# Altium schematic sheet VCO.SchDoc
size A4
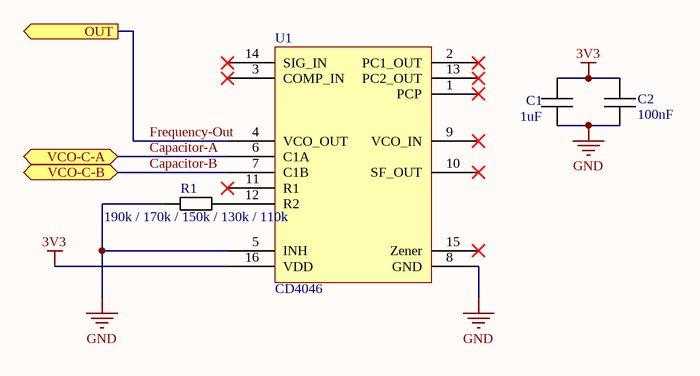
[diagram p0: VCO.SchDoc]

## Parts
C1  1uF  [C 0805 / 2012]
C2  100nF  [C 0805 / 2012]
R1  190k / 170k / 150k / 130k / 110k  [R 0805 / 2012]
U1  CD4046  [SOIC-16]

## Ports
OUT (out), VCO-C-A (bidir), VCO-C-B (bidir)

## Nets
3V3: C1.1 C2.1 U1.16(VDD)
GND: C1.2 C2.2 R1.2 U1.5(INH) U1.8(GND)
Capacitor-A: U1.6(C1A) ; port VCO-C-A
Capacitor-B: U1.7(C1B) ; port VCO-C-B
Frequency-Out: U1.4(VCO_OUT) ; port OUT
NetR1_1: R1.1 U1.12(R2)

Not connected (* = marked no-connect by the designer): U1 1(PCP)* 2(PC1_OUT)* 3(COMP_IN)* 9(VCO_IN)* 10(SF_OUT)* 11(R1)* 13(PC2_OUT)* 14(SIG_IN)* 15(Zener)*

## Library data of the parts
C1 C2 = Capacitor
R1 = Resistor
U1 = CD4046: PLL / VCO